# Altium schematic sheet Gate_driver_circuit.SchDoc: Sheet_name
size A4; CheckedBy: Hildo / Joel / Luís; Author: Fellipe; Organization: UNICAMP / LCEE; Address1: University of Campinas - Brazil; Address2: Power Conditioning Laboratory; Address3: Licensed by GNU GPL 3.0; ProjectName: Easy Inverter
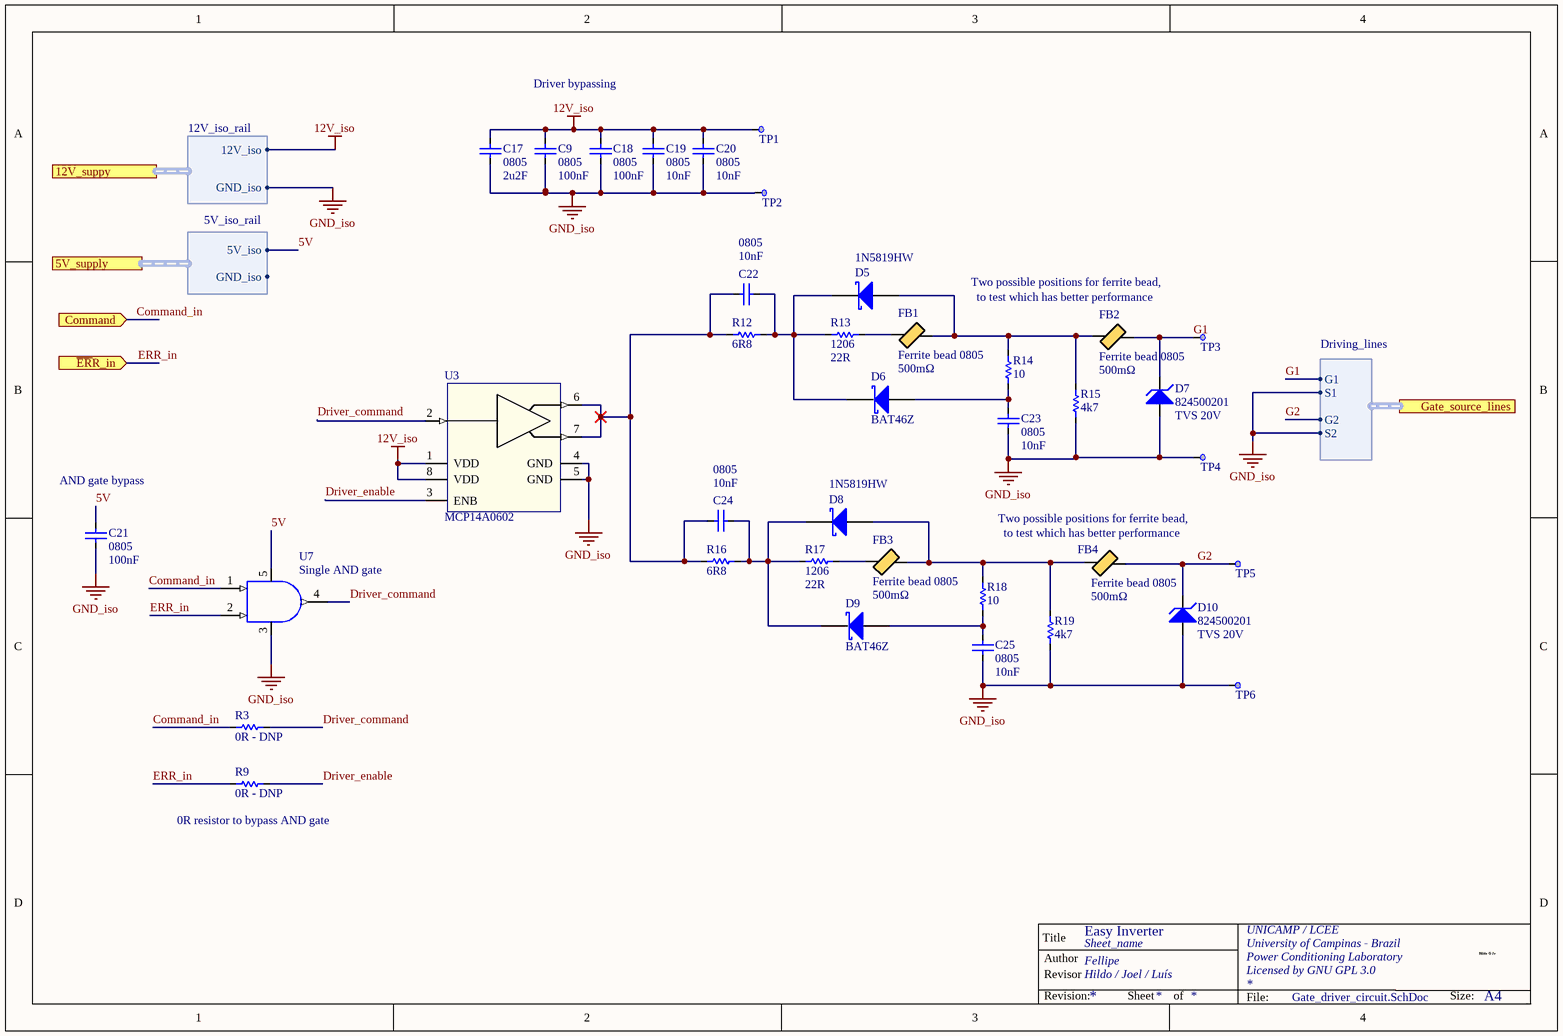
[diagram p0: Gate_driver_circuit.SchDoc]

## Parts
C9  0805  value 100nF  [Capacitor 0805]
C17  0805  value 2u2F  [Capacitor 0805]
C18  0805  value 100nF  [Capacitor 0805]
C19  0805  value 10nF  [Capacitor 0805]
C20  0805  value 10nF  [Capacitor 0805]
C21  0805  value 100nF  [Capacitor 0805]
C22  0805  value 10nF  [Capacitor 0805]
C23  0805  value 10nF  [Capacitor 0805]
C24  0805  value 10nF  [Capacitor 0805]
C25  0805  value 10nF  [Capacitor 0805]
D5  1N5819HW  [SOD 123]
D6  BAT46Z  [SOD 123]
D7  824500201  value TVS 20V  [DO 214]
D8  1N5819HW  [SOD 123]
D9  BAT46Z  [SOD 123]
D10  824500201  value TVS 20V  [DO 214]
FB1  Ferrite bead 0805  DC resistance: 500mΩ  [Bead 0805]
FB2  Ferrite bead 0805  DC resistance: 500mΩ  [Bead 0805]
FB3  Ferrite bead 0805  DC resistance: 500mΩ  [Bead 0805]
FB4  Ferrite bead 0805  DC resistance: 500mΩ  [Bead 0805]
R3  value 0R - DNP  [Resistor 0805]  (hidden comment: Resistor 0805)
R9  value 0R - DNP  [Resistor 0805]  (hidden comment: Resistor 0805)
R12  value 6R8  [Resistor 0805]  (hidden comment: Resistor 0805)
R13  1206  value 22R  [Resistor 1206]
R14  value 10  [Resistor 0805]  (hidden comment: Resistor 0805)
R15  value 4k7  [Resistor 0805]  (hidden comment: Resistor 0805)
R16  value 6R8  [Resistor 0805]  (hidden comment: Resistor 0805)
R17  1206  value 22R  [Resistor 1206]
R18  value 10  [Resistor 0805]  (hidden comment: Resistor 0805)
R19  value 4k7  [Resistor 0805]  (hidden comment: Resistor 0805)
TP1  Name of signal  [Test point]  (value not drawn)  (no BOM)
TP2  Name of signal  [Test point]  (value not drawn)  (no BOM)
TP3  Name of signal  [Test point]  (value not drawn)  (no BOM)
TP4  Name of signal  [Test point]  (value not drawn)  (no BOM)
TP5  Name of signal  [Test point]  (value not drawn)  (no BOM)
TP6  Name of signal  [Test point]  (value not drawn)  (no BOM)
U3  value MCP14A0602  [SOIC 8]  (hidden comment: GateDriver 6A)
U7  Single AND gate  [SOT353]

## Ports
5V_supply (harness 5V_iso_rail), 12V_suppy (harness 12V_iso_rail), Command (in), Gate_source_lines (harness Driving_lines), ~{ER}R_in (in)

## Harnesses
12V_iso_rail: GND_iso, 12V_iso
Driving_lines: G1, G2, S1, S2
5V_iso_rail: 5V_iso, GND_iso

## Nets
12V_iso: C9.1 C17.1 C18.1 C19.1 C20.1 TP1.1 U3.1(VDD) U3.8(VDD) ; port 12V_suppy.12V_iso
GND_iso: C9.2 C17.2 C18.2 C19.2 C20.2 C21.2 C23.2 C25.2 D7.1(A) D10.1(A) R15.1 R19.1 TP2.1 TP4.1 TP6.1 U3.4(GND) U3.5(GND) U7.3(GND) ; port 12V_suppy.GND_iso, port Gate_source_lines.S1, port Gate_source_lines.S2
5V: C21.1 U7.5(VCC) ; port 5V_supply.5V_iso
Command_in: R3.1 U7.1(A) ; port Command
Driver_command: R3.2 U3.2 U7.4(Y)
Driver_enable: R9.2 U3.3(ENB)
ERR_in: R9.1 U7.2(B) ; port ~{ER}R_in
G1: D7.2(K) FB2.2 TP3.1 ; port Gate_source_lines.G1
G2: D10.2(K) FB4.2 TP5.1 ; port Gate_source_lines.G2
NetC22_1: C22.1 D5.2(K) D6.2(K) R12.1 R13.1
NetC22_2: C22.2 C24.2 R12.2 R16.2 U3.6 U3.7
NetC23_1: C23.1 D6.1(A) R14.1
NetC24_1: C24.1 D8.2(K) D9.2(K) R16.1 R17.1
NetC25_1: C25.1 D9.1(A) R18.1
NetD5_1: D5.1(A) FB1.2 FB2.1 R14.2 R15.2
NetD8_1: D8.1(A) FB3.2 FB4.1 R18.2 R19.2
NetFB1_1: FB1.1 R13.2
NetFB3_1: FB3.1 R17.2

## Notes on the sheet
- Driver bypassing
- Two possible positions for ferrite bead,
- to test which has better performance
- (near C21) AND gate bypass
- (near R9) 0R resistor to bypass AND gate
- Title
- Author
- Revisor
- Hildo G Jr
- Revision:
- Sheet
- of
- File:
- Size:
- A4
- HGJr

## Library data of the parts
C9 C17-C25 = Capacitor 0805: SMD ceramic capacitor 0805; pn: undefined
  C9 C17-C20 C22-C25: ClassName: Direct_plane_connect
D5 D8 = 1N5819HW: DIODE SCHOTTKY 40V 1A SOD123; pn: 1N5819HW-7-F; Value: 1N5819HW; ClassName: Direct_plane_connect
D6 D9 = BAT46Z: DIODE SCHOTTKY 100V 150MA SOD123; pn: BAT46ZFILM; Value: BAT46Z
D7 D10 = 824500201: TVS DIODE 20V 32.4V; PN: 824500201; ClassName: Direct_plane_connect
FB1-FB4 = Ferrite_bead: Ferrite bead chip 0805; pn: CIM21J252NE; 782853152; 742792097; MMZ2012Y202BT000; CIC21J601NE;  MI0805J102R-10; CIM21J202NE;; Value: Resistance @ Frequency; ComponentLink1Description: CIM21J252NE; ComponentLink1URL: http://www.samsungsem.com/kr/support/product-search/bead/__icsFiles/afieldfile/2014/11/13/S_CIM21J252NE.pdf; ComponentLink2Description: 782853152; ComponentLink2URL: http://katalog.we-online.de/pbs/datasheet/782853152.pdf; ComponentLink3Description: 742792097; ComponentLink3URL: http://katalog.we-online.de/pbs/datasheet/742792097.pdf; ComponentLink4Description: MMZ2012Y202BT000; ComponentLink4URL: https://product.tdk.com/info/en/catalog/datasheets/beads_commercial_signal_mmz2012_en.pdf; ComponentLink5Description: CIC21J601NE; ComponentLink5URL: http://www.samsungsem.com/kr/support/product-search/bead/__icsFiles/afieldfile/2014/11/13/S_CIC21J601NE.pdf; ComponentLink6Description: MI0805J102R-10; ComponentLink6URL: https://assets.lairdtech.com/home/brandworld/files/MI0805J102R-10.pdf; ComponentLink7Description: CIM21J202NE; ComponentLink7URL: http://www.samsungsem.com/kr/support/product-search/bead/__icsFiles/afieldfile/2014/11/13/S_CIM21J202NE.pdf
R3 R9 R12 R14-R16 R18 R19 = Resistor 0805: SMD resistor 0805; pn: undefined
  R12 R14-R16 R19: ClassName: Direct_plane_connect
R13 R17 = Resistor 1206: SMD resistor 1206; pn: undefined; ClassName: Direct_plane_connect
TP1 = Test point: Test point to probe with oscilloscope; Signal_name: 12V; ClassName: Direct_plane_connect
TP2 = Test point: Test point to probe with oscilloscope; Signal_name: GND; ClassName: Direct_plane_connect
TP3 = Test point: Test point to probe with oscilloscope; Signal_name: G1; ClassName: Direct_plane_connect
TP4 = Test point: Test point to probe with oscilloscope; Signal_name: S1; ClassName: Direct_plane_connect
TP5 = Test point: Test point to probe with oscilloscope; Signal_name: G2; ClassName: Direct_plane_connect
TP6 = Test point: Test point to probe with oscilloscope; Signal_name: S2; ClassName: Direct_plane_connect
U3 = MCP14A0602: MOSFET DRIVER 6A 8SOIC; PN: MCP14A0602-E/SN; ClassName: Direct_plane_connect
U7 = 74AHCT1G08: Single AND gate, package SOT353; value: 74AHCT1G08SE-7; pn: 74AHCT1G08